# Altium schematic sheet POWERREG.SchDoc
size A3; SheetNumber: 9; SheetTotal: 14; SPICEModelCacheORBVXWHQ: <root> / <DocumentId>ORBVXWHQ</DocumentId> / <CacheFrame Number="0"> / <Model Name="emk105bj105_v-f" Kind="CKT"> / <Text>* EMK105BJ105_V-F     SPICE MODEL  ( General Type ) / *-------------------------------------------------------------------------------------------------------- / * Model Generated by TAIYO YUDEN Corporation (http://www.ty-top.com) / * Version 1.0 / * TAIYO YUDEN Control No. 170508_130520 / * Copyright(c) 2012 TAIYO YUDEN CO.,LTD. All Rights Reserved. / *-------------------------------------------------------------------------------------------------------- / * / * Products Name : Multilayer Ceramic Capacitors / * / * Characteristics : / *     Capacitance : 1 uF , Rated Voltage : 16V , TCC : X5R / *     Case Size : 1.0 x 0.5 / 0.039 x 0.02 [mm/inch] , Thickness : 0.5 / 0.02 [mm/inch] / *     (Conditions: Temperature = 25 degC , DC Bias Current/Voltage = 0A / 0V) / * / * Frequency Range : 40Hz - 3GHz / * / * External Node Assignments : / * / *  1  o---| |---o  2 / * / *-------------------------------------------------------------------------------------------------------- / .SubCkt EMK105BJ105_V-F 1 2 / **************************** / C0 1 110 0.68309u / Cm 1 101 0.26053u / C1 101 102 0.94076u / Rc1 101 102 1.9029k / C2 102 103 0.66707u / Rc2 102 103 120.36 / C3 103 110 0.57203u / Rc3 103 110 2.1097 / C2m 1 301 0.1871u / C21 301 302 3.2494u / Rc21 301 302 1.1117k / C22 302 303 2.1014u / Rc22 302 303 1.484k / C23 303 304 2.1172u / Rc23 303 304 1.3876k / C24 304 305 0.75729u / Rc24 304 305 332.59 / C25 305 306 0.94401u / Rc25 305 306 249.09 / C26 306 307 0.34674u / Rc26 306 307 28.352 / C27 307 308 0.37158u / Rc27 307 308 19.989 / C28 308 309 0.17933u / Rc28 308 309 31.748 / C29 309 110 0.016445u / Rc29 309 110 1.0592 / Rp0 1 110 100Meg / L0 110 120 0.2216n / Lm 120 130 0.1509n / L1 120 121 0.12659n / RL1 121 130 0.85161 / L2 120 122 0.15996n / RL2 122 130 0.42469 / L3 120 123 7.9543n / RL3 123 130 0.54643m / CR 120 124 0.24334u / LR 124 125 0.090738n / RR 125 130 68.076m / CL 130 140 2.7354p / LL 130 140 0.10762n / RL 130 140 50.614 / Rs 140 2 7.5416m / **************************** / .ends EMK105BJ105_V-F</Text> / </Model> / </CacheFrame> / </root>
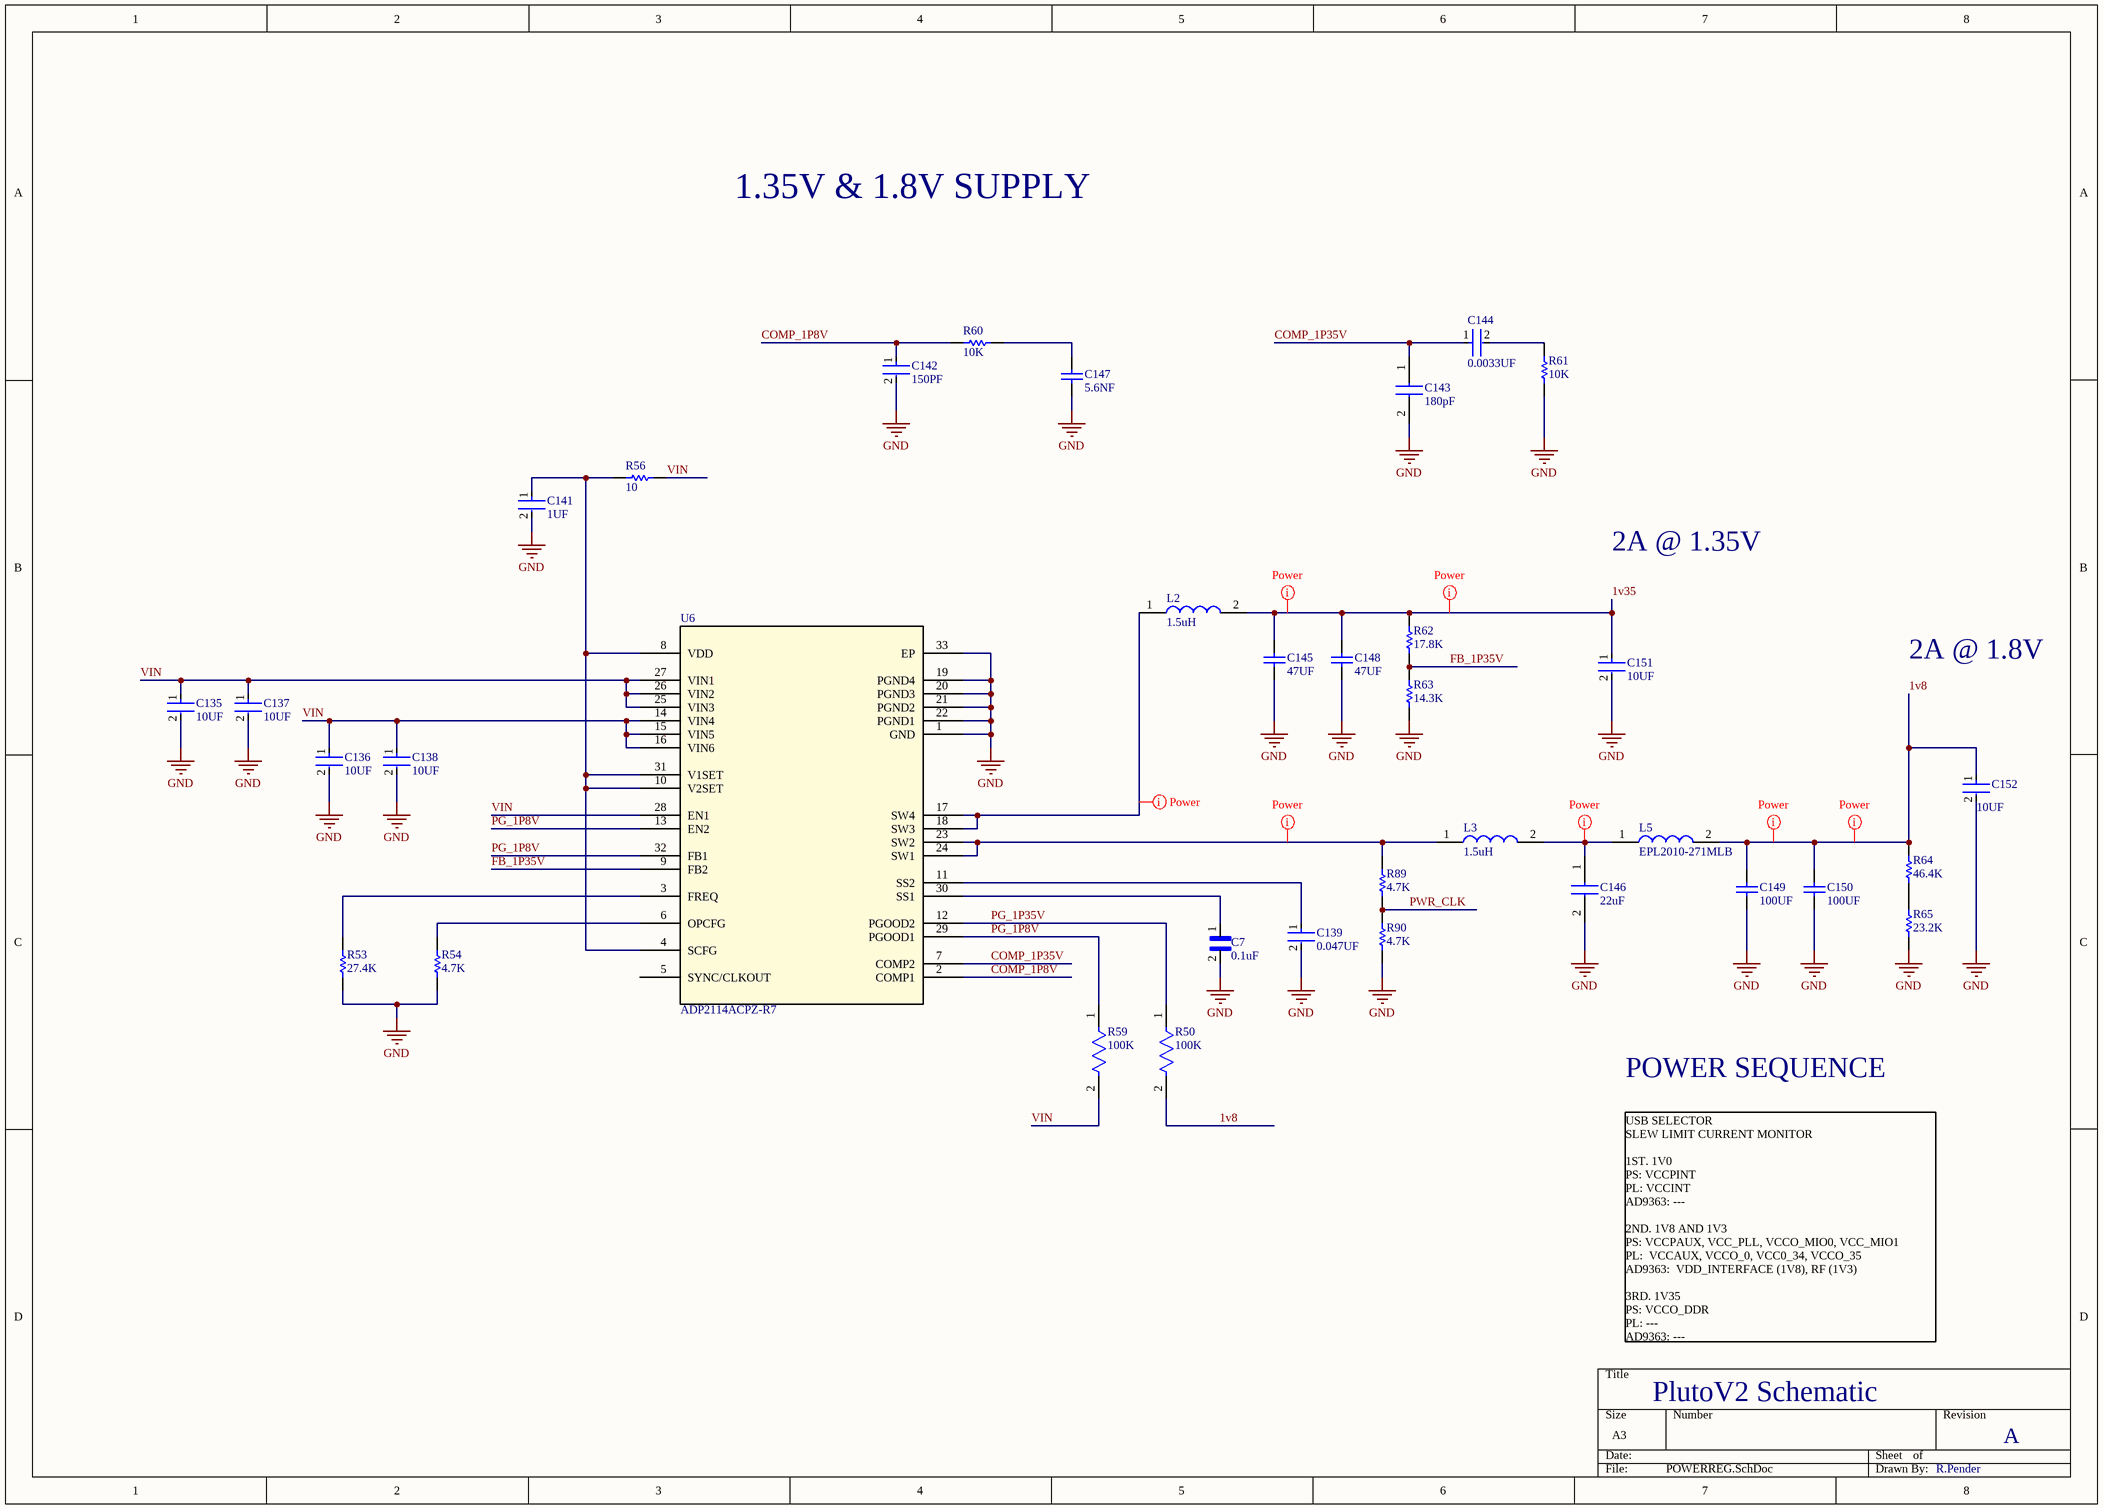
[diagram p0: POWERREG.SchDoc]

## Parts
C7  0.1uF  [CAPC0603X33N]
C135  10UF  [FP-GRM188-0_15-MFG]
C136  10UF  [FP-GRM188-0_15-MFG]
C137  10UF  [FP-GRM188-0_15-MFG]
C138  10UF  [FP-GRM188-0_15-MFG]
C139  0.047UF  [FP-GCM155-0_05-IPC_C]
C141  1UF  [FP-0402-L_1_0_0_05-W_0_5-IPC_A]
C142  150PF  [FP-GCM155-0_05-IPC_C]
C143  180pF  [CAPC1005X55N]
C144  0.0033UF  [FP-CC0402-MFG]
C145  47UF  [TAYO-JMK212BBJ476MG-T_L]
C146  22uF  [CAPC2012X95N]
C147  5.6NF  [CAPC1005X56X25NL10T15]
C148  47UF  [TAYO-JMK212BBJ476MG-T_L]
C149  100UF  [CAPC3216X190X55ML30T25]
C150  100UF  [CAPC3216X190X55ML30T25]
C151  10UF  [FP-GRM188-0_1-e0_2_0_55-IPC_A]
C152  10UF  [FP-GRM188-0_1-e0_2_0_55-IPC_A]
L2  1.5uH  [XFL4020152MEB]
L3  1.5uH  [XFL4020152MEB]
L5  EPL2010-271MLB  [EPL2010271MLB]
R50  100K  [FP-ERJ2RK-IPC_C]
R53  27.4K  [2-0402]
R54  4.7K  [2-0402]
R56  10  [RESC0603X26X15LL03T05]
R59  100K  [FP-ERJ2RK-IPC_C]
R60  10K  [2-0402]
R61  10K  [2-0402]
R62  17.8K  [3-0603]
R63  14.3K  [3-0603]
R64  46.4K  [2-0402]
R65  23.2K  [2-0402]
R89  4.7K  [2-0402]
R90  4.7K  [2-0402]
U6  ADP2114ACPZ-R7  [CP_32_2_ADI]

## Nets
GND: C7.2 C135.2 C136.2 C137.2 C138.2 C139.2 C141.2 C142.2 C143.2 C145.2 C146.2 C147.2 C148.2 C149.2 C150.2 C151.2 C152.2 R53.2 R54.2 R61.2 R63.2 R65.2 R90.2 U6.1(GND) U6.19(PGND4) U6.20(PGND3) U6.21(PGND2) U6.22(PGND1) U6.33(EP)
1v8: C149.1 C150.1 C152.1 L5.2 R50.2 R64.1
1v35: C145.1 C148.1 C151.1 L2.2 R62.1
COMP_1P8V: C142.1 R60.1 U6.2(COMP1)
COMP_1P35V: C143.1 C144.1 U6.7(COMP2)
FB_1P35V: R62.2 R63.1 U6.9(FB2)
PG_1P8V: R59.1 U6.13(EN2) U6.29(PGOOD1) U6.32(FB1)
PG_1P35V: R50.1 U6.12(PGOOD2)
PWR_CLK: R89.2 R90.1
VIN: C135.1 C136.1 C137.1 C138.1 R56.2 R59.2 U6.14(VIN4) U6.15(VIN5) U6.16(VIN6) U6.25(VIN3) U6.26(VIN2) U6.27(VIN1) U6.28(EN1)
NetC7_1: C7.1 U6.30(SS1)
NetC139_1: C139.1 U6.11(SS2)
NetC141_1: C141.1 R56.1 U6.4(SCFG) U6.8(VDD) U6.10(V2SET) U6.31(V1SET)
NetC144_2: C144.2 R61.1
NetC146_1: C146.1 L3.2 L5.1
NetC147_1: C147.1 R60.2
NetL2_1: L2.1 U6.17(SW4) U6.18(SW3)
NetL3_1: L3.1 R89.1 U6.23(SW2) U6.24(SW1)
NetR53_1: R53.1 U6.3(FREQ)
NetR54_1: R54.1 U6.6(OPCFG)
NetR64_2: R64.2 R65.1

Not connected (* = marked no-connect by the designer): U6 5(SYNC/CLKOUT)

## Layout directives
net class Power: 1v8, 1v35, NetC146_1, NetL2_1, NetL3_1

## Notes on the sheet
- 1.35V & 1.8V SUPPLY
- 2A @ 1.35V
- 2A @ 1.8V
- POWER SEQUENCE
- USB SELECTOR                                                                                                    SLEW LIMIT CURRENT MONITOR
  1ST. 1V0
  PS: VCCPINT
  PL: VCCINT
  AD9363: ---
  2ND. 1V8 AND 1V3
  PS: VCCPAUX, VCC_PLL, VCCO_MIO0, VCC_MIO1
  PL:  VCCAUX, VCCO_0, VCC0_34, VCCO_35
  AD9363:  VDD_INTERFACE (1V8), RF (1V3)
  3RD. 1V35
  PS: VCCO_DDR
  PL: ---
  AD9363: ---
- PlutoV2 Schematic
- A
- R.Pender

## Library data of the parts
C7 = GRM033R61C104ME84D: CAP 0.1UF 16VDC X5R 20% SMD 0201 PAPER TAPE; Package: None; Price: None; Value: *; MP: GRM033R61C104ME84D; Availability: Unavailable
C135-C138 = CMP-06035-003612-1: Chip Multilayer Ceramic Capacitors for General Purpose, 0603, 10uF, X5R, 15%, 20%, 10V; Tolerance: 20%; Dielectric: X5R; Package Quantity: 4000; Width: 0.8mm; Case/Package: 0603; Thickness: 0.035inch; Capacitance: 10uF; Voltage Rating: 10V; Voltage Rating (DC): 10V; Termination: SMD/SMT; Length: 1.6mm; Lead Free: Lead Free; Mount: Surface Mount; Height: 0.8mm; Depth: 0.8mm; Packaging: Tape and Reel; Weight: 0.000222oz; Min Operating Temperature: -55°C; Case Code (Metric): 1608; Max Operating Temperature: 85°C; Case Code (Imperial): 0603; Material: Ceramic
C139 = CMP-2008-03720-2: Ceramic Capacitor for Automotive 47nF ±10% 25VDC X7R 0402 Paper T/R; Voltage Rating: 25V; REACH SVHC: No SVHC; Width: 0.02inch; Packaging: Tape and Reel; Case Code (Metric): 1005; Radiation Hardening: No; Voltage: 25V; Length: 1mm; Capacitance: 47nF; Thickness: 0.022inch; Depth: 0.5mm; Termination: SMD/SMT; Dielectric: X7R; Case/Package: 0402; Ratings: AEC-Q200; Voltage Rating (DC): 25V; Mount: Surface Mount; Max Operating Temperature: 125°C; Package Quantity: 1; Tolerance: 10%; Min Operating Temperature: -55°C; Case Code (Imperial): 0402; Height: 0.5mm
C141 = CMP-14477-000104-2: None; Tolerance: 10%; Voltage Rating: 16V; Dielectric: X5R; Packaging: Tape and Reel; Depth: 0.5mm; Mount: Surface Mount; Thickness: 0.022inch; Package Quantity: 1; Min Operating Temperature: -55°C; Series: M; Voltage Rating (DC): 16V; Termination: SMD/SMT; Case/Package: 0402; Number of Pins: 2; Case Code (Imperial): 0402; Capacitance: 1uF; Length: 1mm; Halogen Free: Halogen Free; Case Code (Metric): 1005; Width: 0.02inch; RoHS Compliant: Yes; Radiation Hardening: No; Max Operating Temperature: 85°C; Height: 0.5mm; Construction: Flat
C142 = CMP-06035-010111-1: Ceramic Capacitor for Automotive 150pF ±1% 50VDC C0G 0402 Paper T/R
C143 = CGJ2B2C0G1H181J050BA: Capacitor; Manufacturer_Name: TDK; Datasheet Link: https://product.tdk.com/system/files/dam/doc/product/capacitor/ceramic/mlcc/catalog/mlcc_highreliability_general_en.pdf; Height: 0.55mm; Manufacturer_Part_Number: CGJ2B2C0G1H181J050BA
C144 = CMP-1034-01779-2: CAP CER 3300PF 50V X7R 0402; Manufacturer: YAGEO; Manufacturer Part Number: CC0402KRX7R9BB332; Temperature Coefficient: 30ppm/°C; Material: Ceramic; Value: 3.3 nF; Tolerance: 0.1; Automotive Grade: NA; ComponentLink2Description: Datasheet; ComponentLink2URL: http://www.yageo.com/documents/recent/UPY-GP_NP0_16V-to-50V_16.pdf; Package: CC0402; Temperature Range High: +125°C; Ipc Land Pattern Name: CAPC10050X50; Octopart: https://octopart.com/cc0402krx7r9bb332-yageo-192887; RoHS: TRUE; Automotive: No; Lead Free: Yes; Temperature Characteristic: X7R; Temperature: -55°C to +125°C; Height: 0.55mm; Category: Cap; Footprint Url: http://www.yageo.com/exep/pages/download/literatures/UPY-C_GEN_24.pdf; Device Class L2: Capacitors; Device Class L3: Ceramic Capacitors; Digikey Description: CAP CER 3300PF 50V X7R 0402; Temperature Range Low: -55°C; Voltage Rating: 50 V; Mouser Description: Multilayer Ceramic Capacitors MLCC - SMD/SMT 3.3nF 50V X7R 10%; Device Class L1: Passive Components; Capacitance: 3.3 nF
C145 C148 = CMP-2000-06498-1: High Value Multilayer Ceramic Capacitor, 47 uF, +/-20%, 6.3 V, -55 to 85 degC, 2-Pin SMD (0805), RoHS, Tape and Reel; Manufacturer: Taiyo Yuden; PCN Part Number: X5R,X7RDielectrics23/Jan/2008; Kits: 587-1797-KIT-ND-KITCAPCERHICAP0603&0805S; Temperature Coefficient: X5R; Tolerance: ±20%; Online Catalog: MSeries; Other Names: 587-1779-1; Capacitance: 47µF; Voltage - Rated: 6.3V; Catalog Drawings: xMKSeries_0805_1.25; Operating Temperature: -55°C~85°C; Mounting Technology: SurfaceMount; Package Reference: 0805; Features: -; Lead Spacing: -; Lead Style: -; Family: CeramicCapacitors; Size / Dimension: 0.079"Lx0.049"W(2.00mmx1.25mm); Package Description: 2-Pin SMD, Body 2.2 x 1.45 mm; Mounting Type: SurfaceMount,MLCC; Package / Case: 0805(2012Metric); Series: M; Category: Capacitors; Packaging: CutTape(CT); Datasheet Version: 10/2015; Datasheet URL: http://datasheet.octopart.com/JMK212BJ476MG-T-Taiyo-Yuden-datasheet-62109412.pdf; Manufacturer URL: http://www.t-yuden.com/; Ratings: -; Height - Seated (Max): -; Standard Package: 1; Thickness (Max): 0.053"(1.35mm); Applications: GeneralPurpose
C146 = CL21A226KPCLRNC: Capacitor; Manufacturer_Name: Samsung Electro-Mechanics; Datasheet Link: https://datasheet.datasheetarchive.com/originals/distributors/DKDS-19/374283.pdf; Height: 0.95mm; Manufacturer_Part_Number: CL21A226KPCLRNC
C147 = CMP-2008-02976-1: Manufacturer: AVX Interconnect / Elco; Part Number: 04025C562JAT2A
C149 C150 = CMP-1662-00011-2: Chip Capacitor, 100 uF, +/- 20%, 6.3 V, -55 to 85 degC, 1206 (3216 Metric), RoHS, Tape and Reel; PartNumber: GRM31CR60J107ME39L; Case\/Package: 1206; Voltage Rating (DC): 6.3 V; Type (Capacitors): X5R; REACH SVHC: No SVHC; Height: 1.6 mm; Tolerance: 20%; Packaging: Tape and Reel; Mount: Surface Mount; PackageDescription: 2-Pin Surface Mount Device, Body 3.2 x 1.6 mm; ComponentLink1URL: http://www.murata.com/; Pins: 2; ComponentLink2Description: Datasheet; PackageReference: 1206; Width: 1.6 mm; Package Quantity: 2000; Capacitance: 100 uF; Min Operating Temperature: -55 degC; Case Code (Imperial): 1206; Max Operating Temperature: 85 degC; DatasheetVersion: 09/2016; Mounting Technology: Surface Mount; Voltage Rating: 6.3 V; ComponentLink1Description: Manufacturer URL; Radiation Hardening: No; Case Code (Metric): 3216; Length: 3.2 mm; ComponentLink2URL: http://psearch.en.murata.com/capacitor/product/GRM31CR60J107ME39%23.pdf; RoHSCompliant: true
C151 C152 = CMP-2006-02792-2: Chip Multilayer Ceramic Capacitors for General Purpose, 0603, 10uF, X5R, 15%, 20%, 6.3V; Packaging: Tape and Reel; Voltage Rating (DC): 6.3V; Width: 0.031inch; Termination: SMD/SMT; Dielectric: X5R; Package Quantity: 4000; Voltage Rating: 6.3V; Capacitance: 10uF; Case/Package: 0603; Min Operating Temperature: -55°C; Voltage: 6.3V; Length: 1.6mm; Thickness: 0.035inch; Lead Free: Lead Free; Depth: 0.8mm; Case Code (Imperial): 0603; Max Operating Temperature: 85°C; Material: Ceramic; Height: 0.8mm; Tolerance: 20%; Mount: Surface Mount; REACH SVHC: No SVHC; Radiation Hardening: No; Case Code (Metric): 1608
L2 L3 = XFL4020-152MEB: Inductor; Manufacturer_Name: COILCRAFT; Datasheet Link: https://componentsearchengine.com//XFL4020-152MEB.pdf; Height: 2.1mm; Mouser2 Part Number: 994-XFL4020-152MEB; Mouser2 Price/Stock: https://www.mouser.com/Search/Refine.aspx?Keyword=994-XFL4020-152MEB; Manufacturer_Part_Number: XFL4020-152MEB
L5 = EPL2010-271MLB: Inductor; Manufacturer_Name: COILCRAFT; Datasheet Link: https://componentsearchengine.com/Datasheets/2/EPL2010-271MLB.pdf; Height: 1.05mm; Manufacturer_Part_Number: EPL2010-271MLB
R50 R59 = CMP-2002-00608-4: RES SMD 100K OHM 1% 1/10W 0402; Resistance: 100kR; Voltage Rating (DC): 50V; Power Rating: 100mW; Temperature Coefficient: 100ppm/°C; Case/Package: 0402; Length: 1mm; Package Quantity: 1; Radiation Hardening: No; Case Code (Metric): 1005; Contact Plating: Tin; Mount: Surface Mount; Depth: 0.5mm; Max Operating Temperature: 155°C; Lead Free: Lead Free; Width: 0.5mm; Composition: Thick Film; Case Code (Imperial): 0402; Tolerance: 1%; Termination: SMD/SMT; Number of Pins: 2; Height: 0.35mm; Voltage Rating: 50V; Military Standard: Not; REACH SVHC: No SVHC; Packaging: Tape and Reel; Min Operating Temperature: -55°C; Max Power Dissipation: 100mW; Features: Automotive AEC-Q200; Number of Terminations: 2
R53 R54 R60 R61 R64 R65 R89 R90 = ERJ2RK: Precision Thick Film Chip Resistor, 10 Ohm to 1M Ohm Range, 1% and 0.5% Tolerance, 0402 Size, 0.063 W; Published: 17-Dec-2003; LatestRevisionDate: 19-Mar-2004; LatestRevisionNote: Silkscreen size reduced.; PackageDocument: Mar-2003; PackageReference: 2-0402; Publisher: Altium Limited; Code_IPC: 1005 [0402]; ComponentLink1Description: Manufacturer Link; ComponentLink1URL: http://www.panasonic.com/industrial/components/resistive_products.htm; ComponentLink2Description: Datasheet; ComponentLink2URL: http://www.panasonic.com/industrial/components/pdf/AOA0000CE2.pdf
R56 = CMP-2004-03448-1: Manufacturer: Panasonic; Part Number: ERJ1GNF10R0C
R62 R63 = ERJ3EK: Precision Thick Film Chip Resistor, 10 Ohm to 1M Ohm Range, 1% and 0.5% Tolerance, 0603 Size, 0.063 W; Published: 17-Dec-2003; LatestRevisionDate: 19-Mar-2004; LatestRevisionNote: Silkscreen size reduced.; PackageDocument: Mar-2003; PackageReference: 3-0603; Publisher: Altium Limited; Code_IPC: 1608 [0603]; ComponentLink1Description: Manufacturer Link; ComponentLink1URL: http://www.panasonic.com/industrial/components/resistive_products.htm; ComponentLink2Description: Datasheet; ComponentLink2URL: http://www.panasonic.com/industrial/components/pdf/AOA0000CE2.pdf
U6 = ADP2114ACPZ-R7: No Description Available; Mfr_Name: Analog Devices Inc; Copyright: Copyright (C) 2022 Ultra Librarian. All rights reserved.; Manufacturer_Part_Number: ADP2114ACPZ-R7; Digi-Key_Part_Number_1: ADP2114ACPZ-R7CT-ND; Digi-Key_Part_Number_2: ADP2114ACPZ-R7DKR-ND; Digi-Key_Part_Number_3: ADP2114ACPZ-R7TR-ND; Digi-Key_Part_Number_4: 2156-ADP2114ACPZ-R7-ND; RefDes: RefDes; Type: DEV